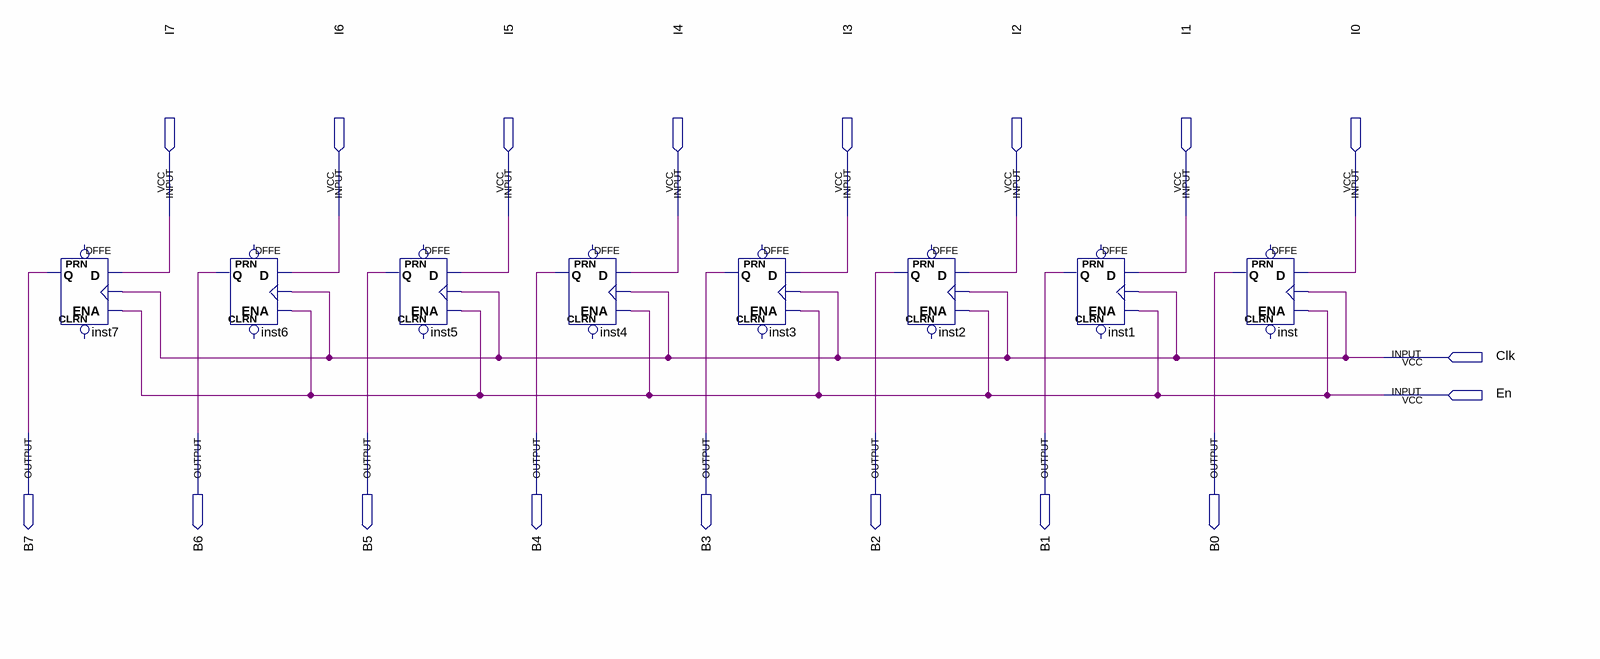
[diagram p0: schematic sheet]
// Quartus schematic 8_bit_parallel_reg.bdf as structural Verilog: 8 symbols, 18 pins
module \8_bit_parallel_reg  (
  input  I7,
  input  I6,
  input  I5,
  input  I4,
  input  I3,
  input  I2,
  input  I1,
  input  I0,
  input  Clk,
  input  En,
  output B7,
  output B6,
  output B5,
  output B4,
  output B3,
  output B2,
  output B1,
  output B0
);

  DFFE inst7 (.D(I7), .CLK(Clk), .ENA(En), .Q(B7));  // open: PRN, CLRN
  DFFE inst6 (.D(I6), .CLK(Clk), .ENA(En), .Q(B6));  // open: PRN, CLRN
  DFFE inst5 (.D(I5), .CLK(Clk), .ENA(En), .Q(B5));  // open: PRN, CLRN
  DFFE inst4 (.D(I4), .CLK(Clk), .ENA(En), .Q(B4));  // open: PRN, CLRN
  DFFE inst3 (.D(I3), .CLK(Clk), .ENA(En), .Q(B3));  // open: PRN, CLRN
  DFFE inst2 (.D(I2), .CLK(Clk), .ENA(En), .Q(B2));  // open: PRN, CLRN
  DFFE inst1 (.D(I1), .CLK(Clk), .ENA(En), .Q(B1));  // open: PRN, CLRN
  DFFE inst (.D(I0), .CLK(Clk), .ENA(En), .Q(B0));  // open: PRN, CLRN
endmodule
